# EAGLE schematic FGG-6 (EAGLE 9.6.0)
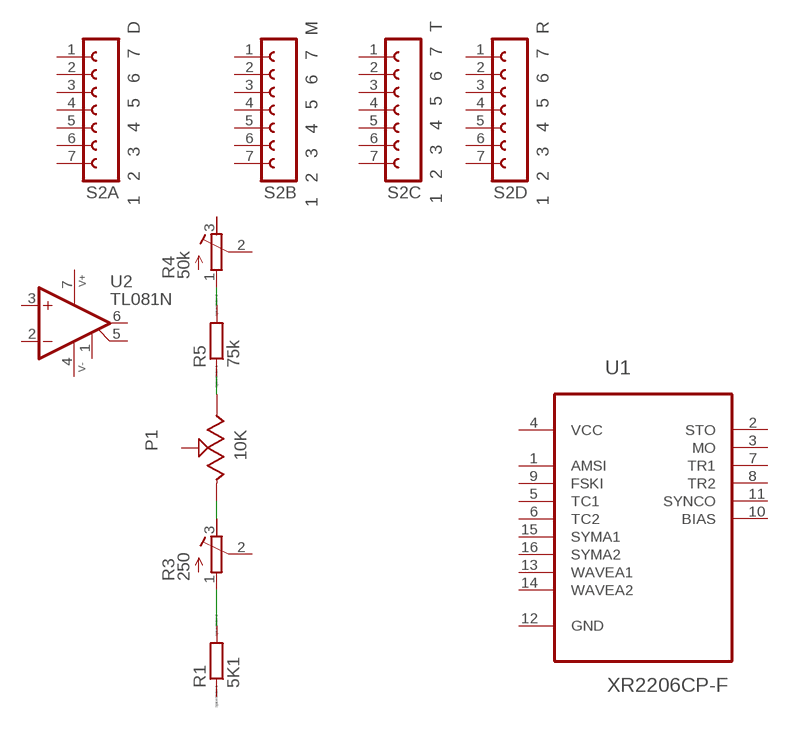
[diagram p0: schematic, sheet 1]

## Parts
P1  10K  91A1A-B28-B15L  [91A1A-B28-B15L-ND]
R1  5K1  R0207/10  [0207/10]
R3  250  R-TRIMM64W  [RTRIM64W]
R4  50k  R-TRIMM64W  [RTRIM64W]
R5  75k  R0207/10  [0207/10]
S2A  1 2 3 4 5 6 7 D  FE07-1  [FE07]
S2B  1 2 3 4 5 6 7 M  FE07-1  [FE07]
S2C  1 2 3 4 5 6 7 T  FE07-1  [FE07]
S2D  1 2 3 4 5 6 7 R  FE07-1  [FE07]
U1  XR2206CP-F  [DIP254P762X533-16]
U2  TL081N  [DIL08]

## Nets
N$1: R1.2 R3.1(A)
N$2: P1.1 R3.3(E)
N$3: P1.3 R5.1
N$4: R4.1(A) R5.2
Unconnected: P1.2 R1.1 R3.2(S) R4.2(S) R4.3(E) S2A.1 S2A.2 S2A.3 S2A.4 S2A.5 S2A.6 S2A.7 S2B.1 S2B.2 S2B.3 S2B.4 S2B.5 S2B.6 S2B.7 S2C.1 S2C.2 S2C.3 S2C.4 S2C.5 S2C.6 S2C.7 S2D.1 S2D.2 S2D.3 S2D.4 S2D.5 S2D.6 S2D.7 U1.1(AMSI) U1.2(STO) U1.3(MO) U1.5(TC1) U1.6(TC2) U1.7(TR1) U1.8(TR2) U1.9(FSKI) U1.10(BIAS) U1.11(SYNCO) U1.12(GND) U1.13(WAVEA1) U1.14(WAVEA2) U1.15(SYMA1) U1.16(SYMA2) U2.1(-NULL:NULL1) U2.2(A:-IN) U2.3(A:+IN) U2.5(-NULL:NULL2) U2.6(A:OUT)

## Power pins joined to a net without a drawn wire
V+: U2.7(P:V+)
V-: U2.4(P:V-)
VCC: U1.4(VCC)

## Library data of the parts
P1 = Potentiometer_Trimmers:91A1A-B28-B15L: POT 10K OHM 1W PLASTIC LINEAR Manufacturer's datasheet <https://www.bourns.com/docs/Product-Datasheets/91_95.pdf>; CREATED_BY: PCBLayout.com; DIGIKEY_PARTNO: 91A1A-B28-B15L-ND; MANUFACTURER: Bourns Inc.; MPN: 91A1A-B28-B15L
R1 R5 = eagle-ltspice:R: RESISTOR, European symbol; SPICEMODEL: NONE; SPICEPREFIX: R
R3 R4 = rcl:R-TRIMM: Trimm resistor; SPICEMODEL: X; SPICEPREFIXL: POT
S2A S2B S2C S2D = con-lsta:FE07-1: FEMALE HEADER; OC_FARNELL: unknown; OC_NEWARK: unknown
U1 = XR2206CP-F:XR2206CP-F: Monolithic Function Generator; AVAILABILITY: Unavailable; DESCRIPTION: IC FUNCTION GENERATOR 16DIP; MF: MaxLinear, Inc.; MP: XR2206CP-F; PACKAGE: PDIP-16 Exar; PRICE: None
U2 = op-amp:TL081: JFET OP-AMP